# Altium schematic sheet deepshark_sch.SchDoc
size A4
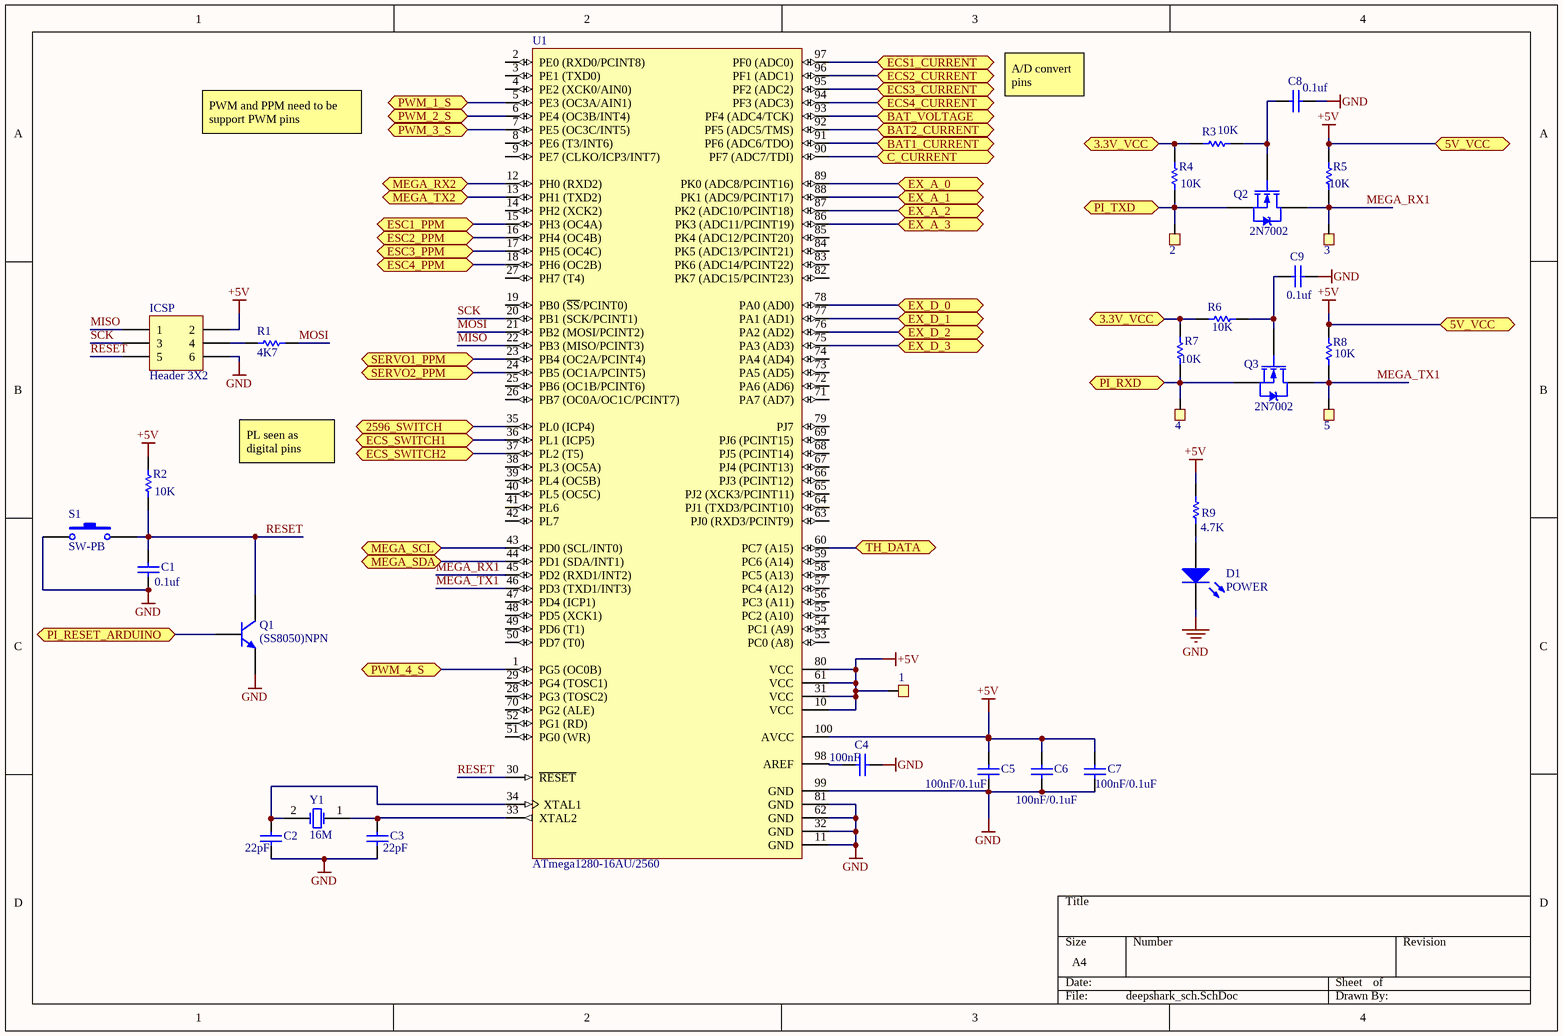
[diagram p0: deepshark_sch.SchDoc]

## Parts
1  TP1  [TestPoint]  (value not drawn)
2  TP  [TestPoint]  (value not drawn)
3  TP  [TestPoint]  (value not drawn)
4  TP  [TestPoint]  (value not drawn)
5  TP  [TestPoint]  (value not drawn)
C1  value 0.1uf  [6-0805_M]  (hidden comment: Cap)
C2  value 22pF  [6-0805_M]  (hidden comment: Cap)
C3  value 22pF  [6-0805_M]  (hidden comment: Cap)
C4  value 100nF  [6-0805_M]  (hidden comment: Cap)
C5  value 100nF/0.1uF  [6-0805_M]  (hidden comment: Cap)
C6  value 100nF/0.1uF  [6-0805_M]  (hidden comment: Cap)
C7  value 100nF/0.1uF  [6-0805_M]  (hidden comment: Cap)
C8  value 0.1uf  [6-0805_M]  (hidden comment: Cap)
C9  value 0.1uf  [6-0805_M]  (hidden comment: Cap)
D1  POWER  [6-0805_M]
ICSP  Header 3X2  [HDR2X3]
Q1  (SS8050)NPN  [SOT89M]
Q2  2N7002  [2N7002]
Q3  2N7002  [2N7002]
R1  value 4K7  [6-0805_M]  (hidden comment: Res1)
R2  value 10K  [6-0805_M]  (hidden comment: Res1)
R3  value 10K  [6-0805_M]  (hidden comment: Res1)
R4  value 10K  [6-0805_M]  (hidden comment: Res1)
R5  value 10K  [6-0805_M]  (hidden comment: Res1)
R6  value 10K  [6-0805_M]  (hidden comment: Res1)
R7  value 10K  [6-0805_M]  (hidden comment: Res1)
R8  value 10K  [6-0805_M]  (hidden comment: Res1)
R9  value 4.7K  [6-0805_M]  (hidden comment: Res1)
S1  SW-PB  [switch4]
U1  ATmega1280-16AU/2560  [100A_N]
Y1  16M  [Y]

## Ports
3.3V_VCC, 5V_VCC, 2596_SWITCH, BAT1_CURRENT, BAT2_CURRENT, BAT_VOLTAGE, C_CURRENT, ECS1_CURRENT, ECS2_CURRENT, ECS3_CURRENT, ECS4_CURRENT, ECS_SWITCH1, ECS_SWITCH2, ESC1_PPM, ESC2_PPM, ESC3_PPM, ESC4_PPM, EX_A_0, EX_A_1, EX_A_2, EX_A_3, EX_D_0, EX_D_1, EX_D_2, EX_D_3, MEGA_RX2, MEGA_SCL, MEGA_SDA, MEGA_TX2, PI_RESET_ARDUINO, PI_RXD, PI_TXD, PWM_1_S, PWM_2_S, PWM_3_S, PWM_4_S, SERVO1_PPM, SERVO2_PPM, TH_DATA

## Nets
+5V: 1.1 C5.2 C6.2 C7.2 ICSP.2 R2.2 R5.2 R8.1 R9.1 U1.10(VCC) U1.31(VCC) U1.61(VCC) U1.80(VCC) U1.100(AVCC) ; port 5V_VCC
GND: C1.1 C2.2 C3.2 C4.1 C5.1 C6.1 C7.1 C8.2 C9.2 D1.2(K) ICSP.6 Q1.3(E) S1.1 U1.11(GND) U1.32(GND) U1.62(GND) U1.81(GND) U1.99(GND)
3.3V_VCC: R3.2 R4.1 R6.1 R7.2 ; port 3.3V_VCC
2596_SWITCH: U1.35(PL0_(ICP4)) ; port 2596_SWITCH
BAT1_CURRENT: U1.91(PF6_(ADC6/TDO)) ; port BAT1_CURRENT
BAT2_CURRENT: U1.92(PF5_(ADC5/TMS)) ; port BAT2_CURRENT
BAT_VOLTAGE: U1.93(PF4_(ADC4/TCK)) ; port BAT_VOLTAGE
C_CURRENT: U1.90(PF7_(ADC7/TDI)) ; port C_CURRENT
ECS1_CURRENT: U1.97(PF0_(ADC0)) ; port ECS1_CURRENT
ECS2_CURRENT: U1.96(PF1_(ADC1)) ; port ECS2_CURRENT
ECS3_CURRENT: U1.95(PF2_(ADC2)) ; port ECS3_CURRENT
ECS4_CURRENT: U1.94(PF3_(ADC3)) ; port ECS4_CURRENT
ECS_SWITCH1: U1.36(PL1_(ICP5)) ; port ECS_SWITCH1
ECS_SWITCH2: U1.37(PL2_(T5)) ; port ECS_SWITCH2
ESC1_PPM: U1.15(PH3_(OC4A)) ; port ESC1_PPM
ESC2_PPM: U1.16(PH4_(OC4B)) ; port ESC2_PPM
ESC3_PPM: U1.17(PH5_(OC4C)) ; port ESC3_PPM
ESC4_PPM: U1.18(PH6_(OC2B)) ; port ESC4_PPM
EX_A_0: U1.89(PK0_(ADC8/PCINT16)) ; port EX_A_0
EX_A_1: U1.88(PK1_(ADC9/PCINT17)) ; port EX_A_1
EX_A_2: U1.87(PK2_(ADC10/PCINT18)) ; port EX_A_2
EX_A_3: U1.86(PK3_(ADC11/PCINT19)) ; port EX_A_3
EX_D_0: U1.78(PA0_(AD0)) ; port EX_D_0
EX_D_1: U1.77(PA1_(AD1)) ; port EX_D_1
EX_D_2: U1.76(PA2_(AD2)) ; port EX_D_2
EX_D_3: U1.75(PA3_(AD3)) ; port EX_D_3
MEGA_RX1: 3.1 Q2.2(D) R5.1 U1.45(PD2_(RXD1/INT2))
MEGA_RX2: U1.12(PH0_(RXD2)) ; port MEGA_RX2
MEGA_SCL: U1.43(PD0_(SCL/INT0)) ; port MEGA_SCL
MEGA_SDA: U1.44(PD1_(SDA/INT1)) ; port MEGA_SDA
MEGA_TX1: 5.1 Q3.2(D) R8.2 U1.46(PD3_(TXD1/INT3))
MEGA_TX2: U1.13(PH1_(TXD2)) ; port MEGA_TX2
MISO: ICSP.1 U1.22(PB3_(MISO/PCINT3))
MOSI: R1.2 U1.21(PB2_(MOSI/PCINT2))
PI_RESET_ARDUINO: Q1.2(B) ; port PI_RESET_ARDUINO
PI_RXD: 4.1 Q3.3(S) R7.1 ; port PI_RXD
PI_TXD: 2.1 Q2.3(S) R4.2 ; port PI_TXD
PWM_1_S: U1.5(PE3_(OC3A/AIN1)) ; port PWM_1_S
PWM_2_S: U1.6(PE4_(OC3B/INT4)) ; port PWM_2_S
PWM_3_S: U1.7(PE5_(OC3C/INT5)) ; port PWM_3_S
PWM_4_S: U1.1(PG5_(OC0B)) ; port PWM_4_S
RESET: C1.2 ICSP.5 Q1.1(C) R2.1 S1.2 U1.30(~{RESET})
SCK: ICSP.3 U1.20(PB1_(SCK/PCINT1))
SERVO1_PPM: U1.23(PB4_(OC2A/PCINT4)) ; port SERVO1_PPM
SERVO2_PPM: U1.24(PB5_(OC1A/PCINT5)) ; port SERVO2_PPM
TH_DATA: U1.60(PC7_(A15)) ; port TH_DATA
NetC2_1: C2.1 U1.34(XTAL1) Y1.2(OSC2)
NetC3_1: C3.1 U1.33(XTAL2) Y1.1(OSC1)
NetC4_2: C4.2 U1.98(AREF)
NetC8_1: C8.1 Q2.1(G) R3.1
NetC9_1: C9.1 Q3.1(G) R6.2
NetD1_1: D1.1(A) R9.2
NetICSP_4: ICSP.4 R1.1

Not connected (* = marked no-connect by the designer): U1 2(PE0_(RXD0/PCINT8)) 3(PE1_(TXD0)) 4(PE2_(XCK0/AIN0)) 8(PE6_(T3/INT6)) 9(PE7_(CLKO/ICP3/INT7)) 14(PH2_(XCK2)) 19(PB0_(~{SS}/PCINT0)) 25(PB6_(OC1B/PCINT6)) 26(PB7_(OC0A/OC1C/PCINT7)) 27(PH7_(T4)) 28(PG3_(TOSC2)) 29(PG4_(TOSC1)) 38(PL3_(OC5A)) 39(PL4_(OC5B)) 40(PL5_(OC5C)) 41(PL6) 42(PL7) 47(PD4_(ICP1)) 48(PD5_(XCK1)) 49(PD6_(T1)) 50(PD7_(T0)) 51(PG0_(WR)) 52(PG1_(RD)) 53(PC0_(A8)) 54(PC1_(A9)) 55(PC2_(A10)) 56(PC3_(A11)) 57(PC4_(A12)) 58(PC5_(A13)) 59(PC6_(A14)) 63(PJ0_(RXD3/PCINT9)) 64(PJ1_(TXD3/PCINT10)) 65(PJ2_(XCK3/PCINT11)) 66(PJ3_(PCINT12)) 67(PJ4_(PCINT13)) 68(PJ5_(PCINT14)) 69(PJ6_(PCINT15)) 70(PG2_(ALE)) 71(PA7_(AD7)) 72(PA6_(AD6)) 73(PA5_(AD5)) 74(PA4_(AD4)) 79(PJ7) 82(PK7_(ADC15/PCINT23)) 83(PK6_(ADC14/PCINT22)) 84(PK5_(ADC13/PCINT21)) 85(PK4_(ADC12/PCINT20))

## Notes on the sheet
- A/D convert pins
- PWM and PPM need to be support PWM pins
- PL seen as digital pins

## Library data of the parts
1 = TP
C1-C9 = Cap: Capacitor; Published: 8-Jun-2000; LatestRevisionDate: 17-Jul-2002; LatestRevisionNote: Re-released for DXP Platform.; PackageReference: RAD-0.3; Publisher: Altium Limited; PackageDescription: Radial Cap, Thru-Hole; 2 Leads; 0.3 in Pin Spacing
D1 = LED0: Typical INFRARED GaAs LED; Published: 8-Jun-2000; LatestRevisionDate: 08-Jul-2005; LatestRevisionNote: Mech Layer 1 removed.; PackageReference: LED-0; Publisher: Altium Limited; PackageDescription: LED; 2 Leads
ICSP = Header 3X2: Header, 3-Pin, Dual row; LatestRevisionDate: 17-Jul-2002; LatestRevisionNote: Re-released for DXP Platform.; Publisher: Altium Limited
Q1 = NPN: NPN Bipolar Transistor; pin to pad: 1>2 2>1; Published: 8-Jun-2000; LatestRevisionDate: 17-Jul-2002; LatestRevisionNote: Re-released for DXP Platform.; PackageReference: TO-226-AA; Publisher: Altium Limited; PackageDescription: TO, Flat Index; 3 In-Line, Axial Leads; Body Dia. 4.8mm; Leads 0.55 x 0.51 mm (max); Code_JEDEC: TO-226-AA
Q2 Q3 = NMOS-2: N-Channel Power MOSFET; Note: Pin 2 is electrically connected to pin 4.; Published: 8-Jun-2000; LatestRevisionDate: 17-Jul-2002; LatestRevisionNote: Re-released for DXP Platform.; DatasheetVersion: PD-9.814; PackageVersion: Feb-1997; PackageReference: TO-220AB; Publisher: Altium Limited; PackageDescription: TO, Thru-Hole, Vertical, Heatsink Mounted; 3 In-Line Leads; Pitch 2.54 mm; ComponentLink1Description: Manufacturer Link; ComponentLink1URL: http://www.irf.com/
R1-R9 = Res1: Resistor; Published: 8-Jun-2000; LatestRevisionDate: 17-Jul-2002; LatestRevisionNote: Re-released for DXP Platform.; PackageReference: AXIAL-0.3; Publisher: Altium Limited; PackageDescription: Axial Device, Thru-Hole; 2 Leads; 0.3 in Pin Spacing
S1 = SW-PB: Switch; Published: 24-Mar-1999; LatestRevisionDate: 17-Jul-2002; LatestRevisionNote: Re-released for DXP Platform.; PackageReference: SPST-2; Publisher: Altium Limited; PackageDescription: Switch; 2 Leads
U1 = ATmega1280-16AU: 8-bit AVR Microcontroller, 2.7-5.5V, 8MHz, 128KB Flash, 4KB EEPROM, 8KB SRAM, 86 GPIO pins, 100-pin TQFP, Industrial Grade (-40癈 to 85癈), Pb-Free; DatasheetVersion: revN, May-2011; PackageVersion: revD, Oct-2010; PackageReference: 100A; PackageDescription: 100-Pin Thin Profile Plastic Quad Flat Pack (TQFP), 14 x 14 x 1.0 mm Body, 0.5 mm Pitch; Code_JEDEC: MS-026-AED; ComponentLink1Description: Manufacturer URL; ComponentLink1URL: http://www.atmel.com/; ComponentLink2Description: ATmega640/1280/1281/2560/2561 Datasheet; ComponentLink2URL: http://www.atmel.com/dyn/resources/prod_documents/doc2549.pdf; ComponentLink3Description: ATmega640/1280/1281/2560/2561 Summary; ComponentLink3URL: http://www.atmel.com/dyn/resources/prod_documents/2549S.pdf
Y1 = XTAL: Crystal Oscillator; Published: 8-Jun-2000; LatestRevisionDate: 17-Jul-2002; LatestRevisionNote: Re-released for DXP Platform.; PackageReference: R38; Publisher: Altium Limited; PackageDescription: Crystal, Thru-Hole; 2 Leads; Body 3.1 x 8.2 mm (Dia.xH)